# Altium schematic sheet MOSFETs.SchDoc
size A
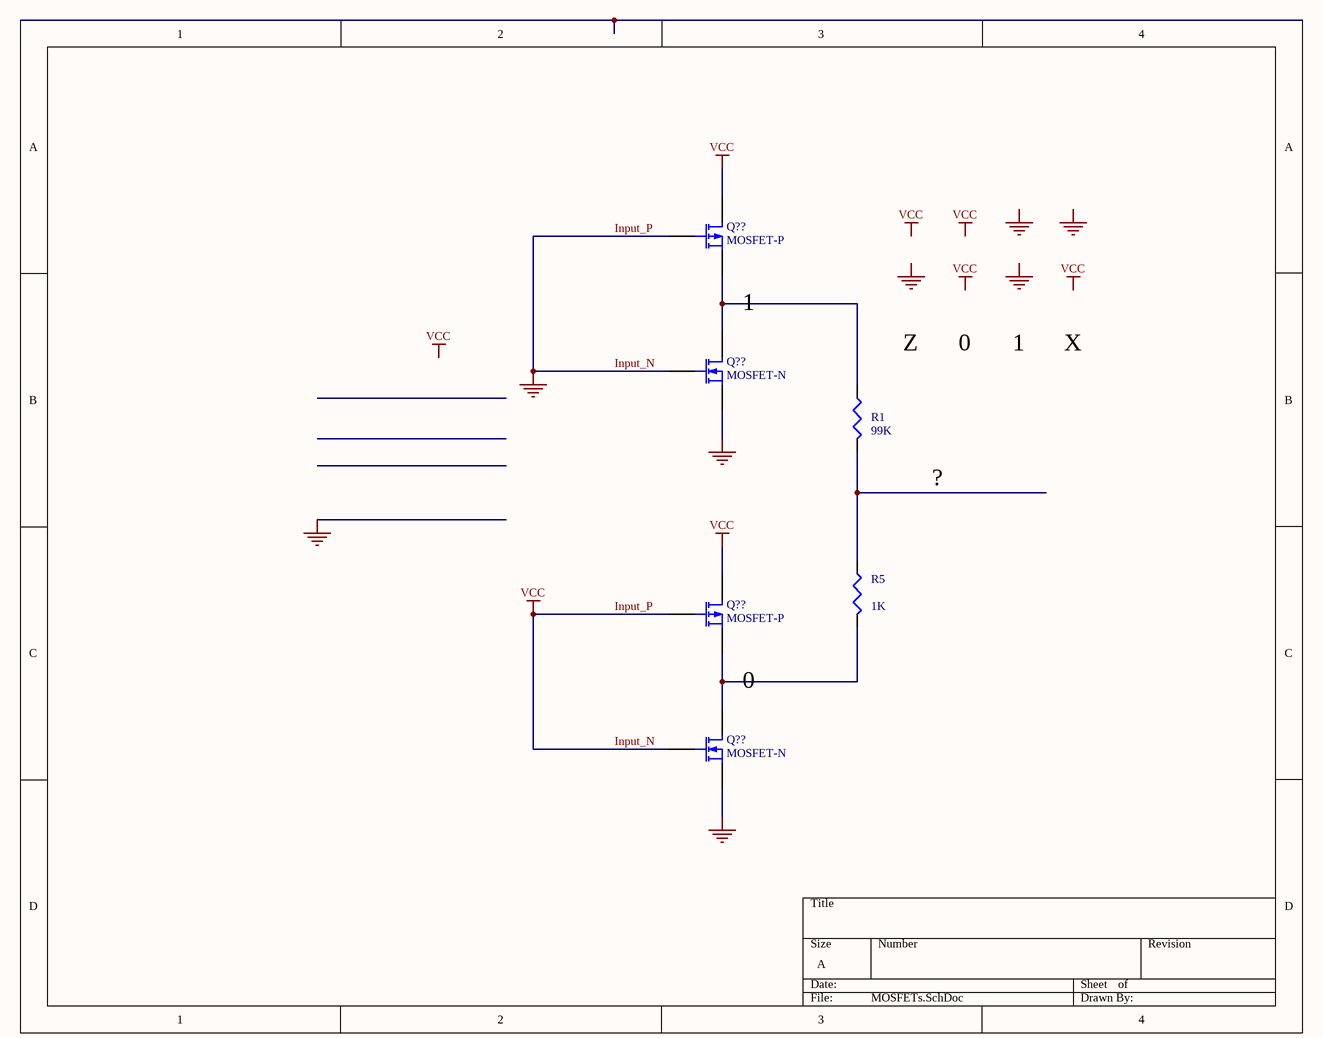
[diagram p0: MOSFETs.SchDoc]

## Parts
(Parts that share a designator on the sheet are numbered #1, #2 ... from top to bottom, then left to right.)
Q??#1  MOSFET-P  [E3]
Q??#2  MOSFET-N  [E3]
Q??#3  MOSFET-P  [E3]
Q??#4  MOSFET-N  [E3]
R1  99K  [12Z-2010]
R5  1K  [12Z-2010]

## Nets
Input_N: Q??#1.1(D) Q??#1.2(G) Q??#2.2(G) Q??#2.3(S) Q??#3.1(D) Q??#3.2(G) Q??#4.2(G) Q??#4.3(S)  [also labelled GND, Input_P, VCC]
NetQ??#1_3: Q??#1.3(S) Q??#2.1(D) R1.1
NetQ??#3_3: Q??#3.3(S) Q??#4.1(D) R5.2
NetR1_2: R1.2 R5.1

## Notes on the sheet
- (near Q??#2) 1
- Z
- 0
- 1
- X
- ?
- (near Q??#4) 0
- Labels drawn without touching a wire or pin: GND, VCC

## Library data of the parts
Q??#1 Q??#3 = MOSFET-P: P-Channel MOSFET; Published: 8-Jun-2000; LatestRevisionDate: 17-Jul-2002; LatestRevisionNote: Re-released for DXP Platform.; PackageVersion: 1995/1996; PackageReference: E3; Publisher: Altium Limited; PackageDescription: TO, Flat Index; 3 In-Line, Axial Leads; Body Dia. 4.6mm; Lead Dia. 0.5 mm (max)
Q??#2 Q??#4 = MOSFET-N: N-Channel MOSFET; Published: 8-Jun-2000; LatestRevisionDate: 17-Jul-2002; LatestRevisionNote: Re-released for DXP Platform.; PackageVersion: 1995/1996; PackageReference: E3; Publisher: Altium Limited; PackageDescription: TO, Flat Index; 3 In-Line, Axial Leads; Body Dia. 4.6mm; Lead Dia. 0.5 mm (max)
R1 = Res3: Resistor; Value: 1K; Published: 8-Jun-2000; LatestRevisionDate: 29-May-2009; LatestRevisionNote: IPC-7351 Footprint Added.; PackageReference: J1-0603; Publisher: Altium Limited; PackageDescription: Chip Resistor
R5 = Res3: Resistor; Published: 8-Jun-2000; LatestRevisionDate: 29-May-2009; LatestRevisionNote: IPC-7351 Footprint Added.; PackageReference: J1-0603; Publisher: Altium Limited; PackageDescription: Chip Resistor; Value: 1K